# EAGLE schematic Audio input (EAGLE 6.2)
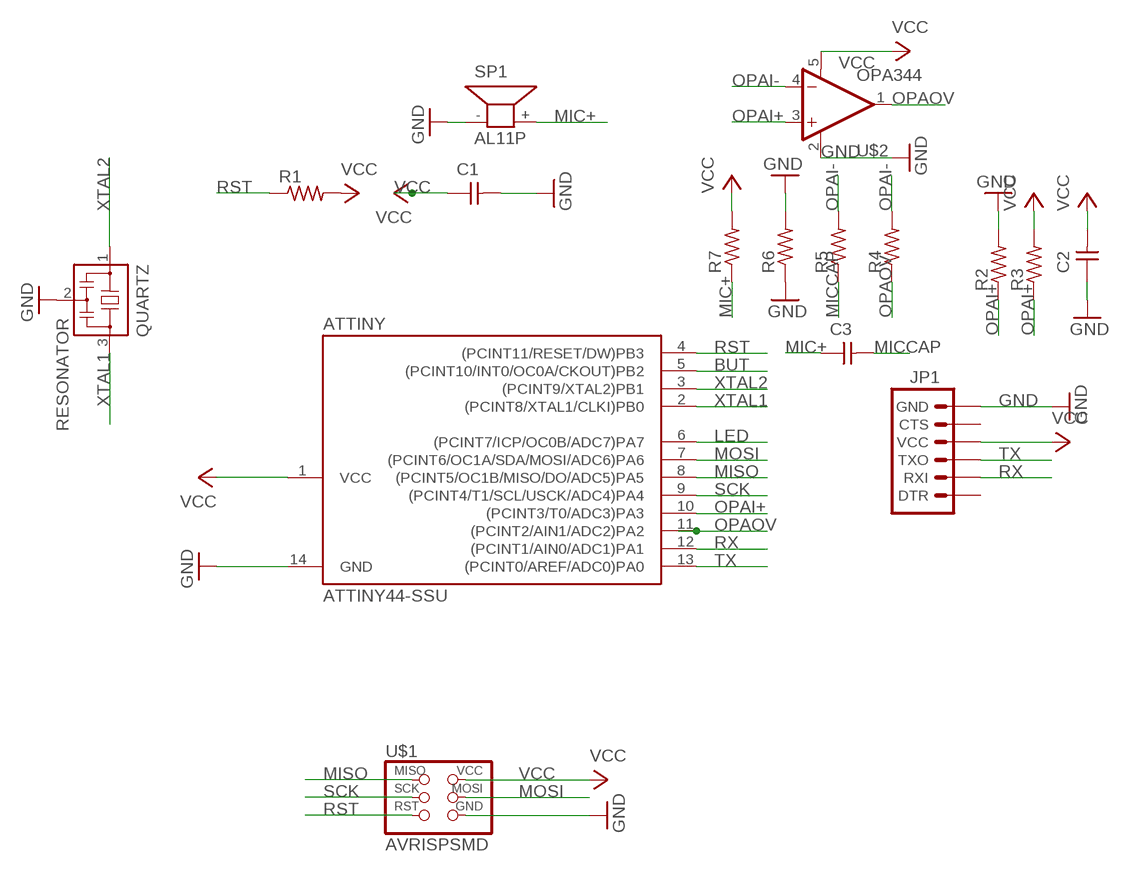
[diagram p0: schematic, sheet 1]

## Parts
ATTINY  ATTINY44-SSU  [SOIC14]
C1  UNPOLARIZED_CAPACITOR1206  [1206]
C2  UNPOLARIZED_CAPACITOR1206  [1206]
C3  UNPOLARIZED_CAPACITOR1206  [1206]
JP1  ARDUINO_SERIAL_PROGRAMLONGPADS  [1X06_LONGPADS]
QUARTZ  RESONATOR  [EFOBM]
R1  RESISTOR1206  [1206]
R2  RESISTOR1206  [1206]
R3  RESISTOR1206  [1206]
R4  RESISTOR1206  [1206]
R5  RESISTOR1206  [1206]
R6  RESISTOR1206  [1206]
R7  RESISTOR1206  [1206]
SP1  AL11P  [AL11P]
U$1  AVRISPSMD  [2X03SMD]
U$2  OPA344  [SOT23-5]

## Nets
BUT: ATTINY.5((PCINT10/INT0/OC0A/CKOUT)PB2)
GND: ATTINY.14(GND) C1.2 C2.1 JP1.6(GND) QUARTZ.2 R2.2 R6.1 R6.2 SP1.- U$1.6(GND) U$2.2(V-)
LED: ATTINY.6((PCINT7/ICP/OC0B/ADC7)PA7)
MIC+: C3.1 R7.1 SP1.+
MICCAP: C3.2 R5.1
MISO: ATTINY.8((PCINT5/OC1B/MISO/DO/ADC5)PA5) U$1.1(MISO)
MOSI: ATTINY.7((PCINT6/OC1A/SDA/MOSI/ADC6)PA6) U$1.4(MOSI)
OPAI+: ATTINY.10((PCINT3/T0/ADC3)PA3) R2.1 R3.1 U$2.3(+IN)
OPAI-: R4.2 R5.2 U$2.4(-IN)
OPAOV: ATTINY.11((PCINT2/AIN1/ADC2)PA2) R4.1 U$2.1(OUT)
RST: ATTINY.4((PCINT11/RESET/DW)PB3) R1.1 U$1.5(RST)
RX: ATTINY.12((PCINT1/AIN0/ADC1)PA1) JP1.2(RXI)
SCK: ATTINY.9((PCINT4/T1/SCL/USCK/ADC4)PA4) U$1.3(SCK)
TX: ATTINY.13((PCINT0/AREF/ADC0)PA0) JP1.3(TXO)
VCC: ATTINY.1(VCC) C1.1 C2.2 JP1.4(VCC) R1.2 R3.2 R7.2 U$1.2(VCC) U$2.5(V+)
XTAL1: ATTINY.2((PCINT8/XTAL1/CLKI)PB0) QUARTZ.3
XTAL2: ATTINY.3((PCINT9/XTAL2)PB1) QUARTZ.1
Unconnected: JP1.1(DTR) JP1.5(CTS)

## Library data of the parts
ATTINY = fab:ATTINY44
C1-C3 = FAB_Hello:UNPOLARIZED_CAPACITOR: unpolarized_capacitor
JP1 = SparkFun-Connectors:ARDUINO_SERIAL_PROGRAM: FTDI connector footprints
QUARTZ = fab:RESONATOR
R1-R7 = ng:RESISTOR
SP1 = buzzer:AL11P: SPEAKER Source: Buerklin; OC_FARNELL: unknown; OC_NEWARK: unknown
U$1 = fab:AVRISP
U$2 = SparkFun-AnalogIC:OPA344: Single gate rail-to-rail output op-amp. Inputs extend 300mV past rails.